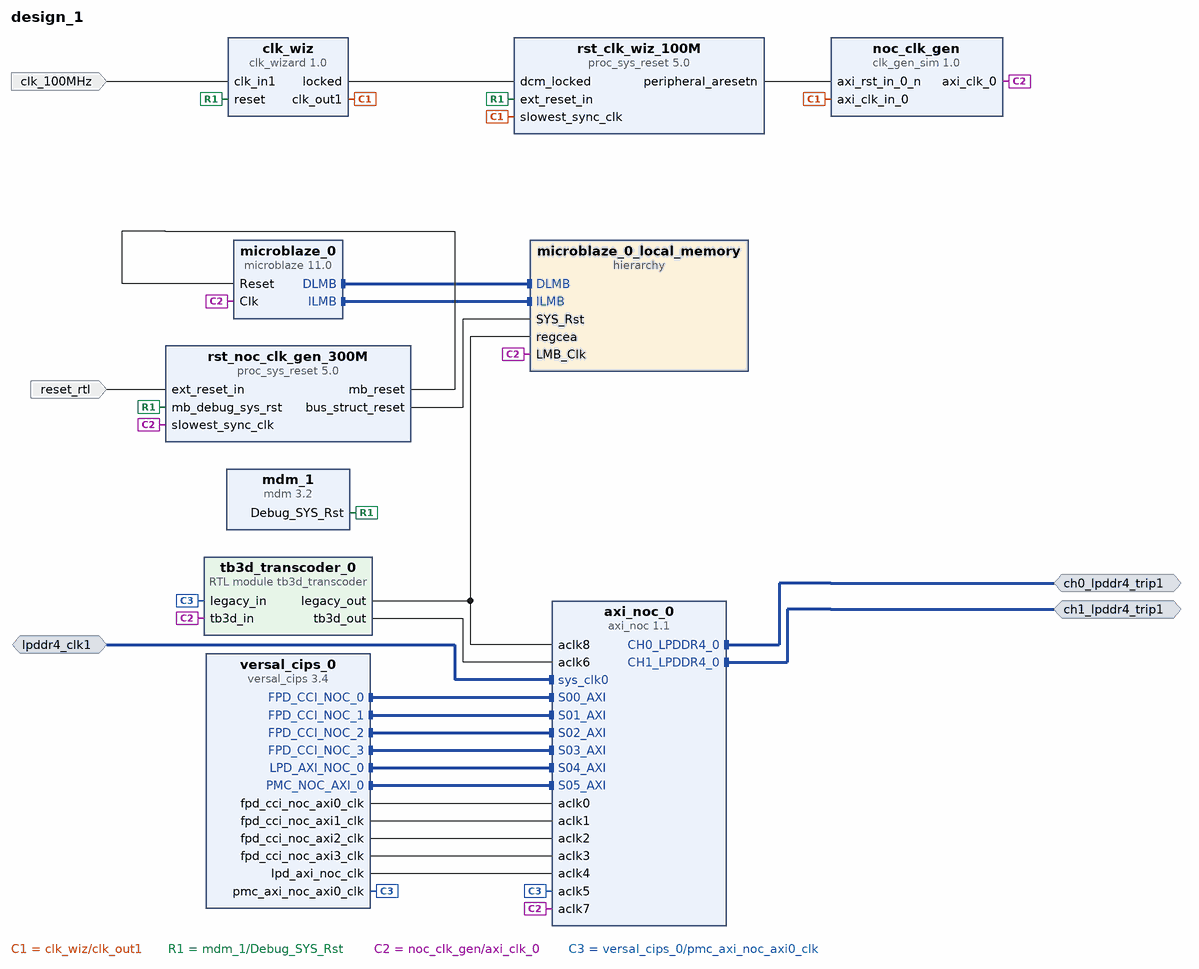
[diagram p0: block diagram of the top level]
# Vivado block design design_1, xcvp1802-lsvc4072-2MP-e-S, Vivado 2025.2
create_bd_design design_1

create_bd_intf_port -mode Master -vlnv xilinx.com:interface:lpddr4_rtl:1.0 ch0_lpddr4_trip1
create_bd_intf_port -mode Master -vlnv xilinx.com:interface:lpddr4_rtl:1.0 ch1_lpddr4_trip1
create_bd_intf_port -mode Slave -vlnv xilinx.com:interface:diff_clock_rtl:1.0 lpddr4_clk1
set_property -dict {CONFIG.FREQ_HZ 200000000} [get_bd_intf_ports lpddr4_clk1]
create_bd_port -dir I -type clk clk_100MHz
set_property -dict {CONFIG.FREQ_HZ 100000000} [get_bd_ports clk_100MHz]
create_bd_port -dir I -type rst reset_rtl
set_property -dict {CONFIG.POLARITY ACTIVE_LOW} [get_bd_ports reset_rtl]

create_bd_cell -type ip -vlnv xilinx.com:ip:microblaze:11.0 microblaze_0
set_property -dict [list \
  CONFIG.C_ADDR_SIZE 32 \
  CONFIG.C_AREA_OPTIMIZED 2 \
  CONFIG.C_DATA_SIZE 64 \
  CONFIG.C_DEBUG_ENABLED 0 \
  CONFIG.C_D_AXI 0 \
  CONFIG.C_D_LMB 1 \
  CONFIG.C_ENABLE_CONVERSION 0 \
  CONFIG.C_ENABLE_DISCRETE_PORTS 0 \
  CONFIG.C_I_AXI 0 \
  CONFIG.C_I_LMB 1 \
  CONFIG.C_M_AXI_DP_DATA_WIDTH 32 \
  CONFIG.C_USE_BRANCH_TARGET_CACHE 1 \
  CONFIG.C_USE_DCACHE 0 \
  CONFIG.C_USE_ICACHE 0 \
  CONFIG.C_USE_MMU 3 \
  CONFIG.C_USE_PCMP_INSTR 1 \
] [get_bd_cells microblaze_0]
create_bd_cell -type module -reference tb3d_transcoder tb3d_transcoder_0
create_bd_cell -type ip -vlnv xilinx.com:ip:axi_noc:1.1 axi_noc_0
set_property -dict [list \
  CONFIG.CH0_LPDDR4_0_BOARD_INTERFACE ch0_lpddr4_trip1 \
  CONFIG.CH1_LPDDR4_0_BOARD_INTERFACE ch1_lpddr4_trip1 \
  CONFIG.MC1_FLIPPED_PINOUT true \
  CONFIG.MC_CHANNEL_INTERLEAVING true \
  CONFIG.MC_CHAN_REGION1 DDR_LOW1 \
  CONFIG.MC_DM_WIDTH 4 \
  CONFIG.MC_DQS_WIDTH 4 \
  CONFIG.MC_DQ_WIDTH 32 \
  CONFIG.MC_EN_INTR_RESP TRUE \
  CONFIG.MC_SYSTEM_CLOCK Differential \
  CONFIG.NUM_CLKS 9 \
  CONFIG.NUM_MC 1 \
  CONFIG.NUM_MCP 4 \
  CONFIG.NUM_MI 0 \
  CONFIG.NUM_SI 6 \
  CONFIG.SI_SIDEBAND_PINS 0,0,0,0,0,0,1 \
  CONFIG.sys_clk0_BOARD_INTERFACE lpddr4_clk1 \
] [get_bd_cells axi_noc_0]
create_bd_cell -type ip -vlnv xilinx.com:ip:versal_cips:3.4 versal_cips_0
set_property -dict [list \
  CONFIG.CPM_CONFIG {CPM_PCIE0_MODES None} \
  CONFIG.DDR_MEMORY_MODE Custom \
  CONFIG.DEBUG_MODE Custom \
  CONFIG.DESIGN_MODE 1 \
  CONFIG.PS_BOARD_INTERFACE ps_pmc_fixed_io \
  CONFIG.PS_PL_CONNECTIVITY_MODE Custom \
  CONFIG.PS_PMC_CONFIG {['DDR_MEMORY_MODE {Connectivity to DDR via NOC}', 'DESIGN_MODE 1', 'DEVICE_INTEGRITY_MODE {Sysmon temperature voltage and external IO monitoring}', 'PMC_GPIO0_MIO_PERIPHERAL {{ENABLE 1} {IO {PMC_MIO 0 .. 25}}}', 'PMC_GPIO1_MIO_PERIPHERAL {{ENABLE 1} {IO {PMC_MIO 26 .. 51}}}', 'PMC_MIO37 {{AUX_IO 0} {DIRECTION out} {DRIVE_STRENGTH 8mA} {OUTPUT_DATA high} {PULL pullup} {SCHMITT 0} {SLEW slow} {USAGE GPIO}}', 'PMC_QSPI_FBCLK {{ENABLE 1} {IO {PMC_MIO 6}}}', 'PMC_QSPI_PERIPHERAL_DATA_MODE x4', 'PMC_QSPI_PERIPHERAL_ENABLE 1', 'PMC_QSPI_PERIPHERAL_MODE {Dual Parallel}', 'PMC_REF_CLK_FREQMHZ 33.3333', 'PMC_SD1 {{CD_ENABLE 1} {CD_IO {PMC_MIO 28}} {POW_ENABLE 1} {POW_IO {PMC_MIO 51}} {RESET_ENABLE 0} {RESET_IO {PMC_MIO 12}} {WP_ENABLE 0} {WP_IO {PMC_MIO 1}}}', 'PMC_SD1_PERIPHERAL {{CLK_100_SDR_OTAP_DLY 0x3} {CLK_200_SDR_OTAP_DLY 0x2} {CLK_50_DDR_ITAP_DLY 0x2A} {CLK_50_DDR_OTAP_DLY 0x3} {CLK_50_SDR_ITAP_DLY 0x25} {CLK_50_SDR_OTAP_DLY 0x4} {ENABLE 1} {IO {PMC_MIO 26 .. 36}}}', 'PMC_SD1_SLOT_TYPE {SD 3.0 AUTODIR}', 'PMC_USE_PMC_NOC_AXI0 1', 'PS_BOARD_INTERFACE ps_pmc_fixed_io', 'PS_ENET0_MDIO {{ENABLE 1} {IO {PS_MIO 24 .. 25}}}', 'PS_ENET0_PERIPHERAL {{ENABLE 1} {IO {PS_MIO 0 .. 11}}}', 'PS_GEN_IPI0_ENABLE 1', 'PS_GEN_IPI0_MASTER A72', 'PS_GEN_IPI1_ENABLE 1', 'PS_GEN_IPI2_ENABLE 1', 'PS_GEN_IPI3_ENABLE 1', 'PS_GEN_IPI4_ENABLE 1', 'PS_GEN_IPI5_ENABLE 1', 'PS_GEN_IPI6_ENABLE 1', 'PS_I2C0_PERIPHERAL {{ENABLE 1} {IO {PMC_MIO 46 .. 47}}}', 'PS_I2C1_PERIPHERAL {{ENABLE 1} {IO {PMC_MIO 44 .. 45}}}', 'PS_I2CSYSMON_PERIPHERAL {{ENABLE 0} {IO {PMC_MIO 39 .. 40}}}', 'PS_MIO7 {{AUX_IO 0} {DIRECTION in} {DRIVE_STRENGTH 8mA} {OUTPUT_DATA default} {PULL disable} {SCHMITT 0} {SLEW slow} {USAGE Reserved}}', 'PS_MIO9 {{AUX_IO 0} {DIRECTION in} {DRIVE_STRENGTH 8mA} {OUTPUT_DATA default} {PULL disable} {SCHMITT 0} {SLEW slow} {USAGE Reserved}}', 'PS_M_AXI_FPD_DATA_WIDTH 32', 'PS_NUM_FABRIC_RESETS 0', 'PS_PCIE_EP_RESET1_IO {PS_MIO 18}', 'PS_PCIE_EP_RESET2_IO {PS_MIO 19}', 'PS_PCIE_RESET {ENABLE 1}', 'PS_PL_CONNECTIVITY_MODE Custom', 'PS_S_AXI_FPD_DATA_WIDTH 32', 'PS_UART0_PERIPHERAL {{ENABLE 1} {IO {PMC_MIO 42 .. 43}}}', 'PS_USB3_PERIPHERAL {{ENABLE 1} {IO {PMC_MIO 13 .. 25}}}', 'PS_USE_FPD_CCI_NOC 1', 'PS_USE_FPD_CCI_NOC0 1', 'PS_USE_M_AXI_FPD 0', 'PS_USE_NOC_LPD_AXI0 1', 'PS_USE_PMCPL_CLK0 0', 'PS_USE_PMCPL_CLK1 0', 'PS_USE_PMCPL_CLK2 0', 'PS_USE_PMCPL_CLK3 0', 'PS_USE_S_AXI_FPD 0', 'SMON_ALARMS Set_Alarms_On', 'SMON_ENABLE_TEMP_AVERAGING 0', 'SMON_INTERFACE_TO_USE I2C', 'SMON_PMBUS_ADDRESS 0x18', 'SMON_TEMP_AVERAGING_SAMPLES 0']} \
] [get_bd_cells versal_cips_0]
create_bd_cell -type hier microblaze_0_local_memory
create_bd_cell -type ip -vlnv xilinx.com:ip:mdm:3.2 mdm_1
create_bd_cell -type ip -vlnv xilinx.com:ip:proc_sys_reset:5.0 rst_noc_clk_gen_300M
create_bd_cell -type ip -vlnv xilinx.com:ip:clk_wizard:1.0 clk_wiz
set_property -dict [list \
  CONFIG.CLKOUT_REQUESTED_OUT_FREQUENCY 100.0 \
  CONFIG.USE_LOCKED true \
  CONFIG.USE_RESET true \
] [get_bd_cells clk_wiz]
create_bd_cell -type ip -vlnv xilinx.com:ip:clk_gen_sim:1.0 noc_clk_gen
set_property -dict {CONFIG.USER_AXI_CLK_0_FREQ 300.0 CONFIG.USER_NUM_OF_AXI_CLK 1} [get_bd_cells noc_clk_gen]
create_bd_cell -type ip -vlnv xilinx.com:ip:proc_sys_reset:5.0 rst_clk_wiz_100M

# ---- hierarchy /microblaze_0_local_memory ----
current_bd_instance /microblaze_0_local_memory
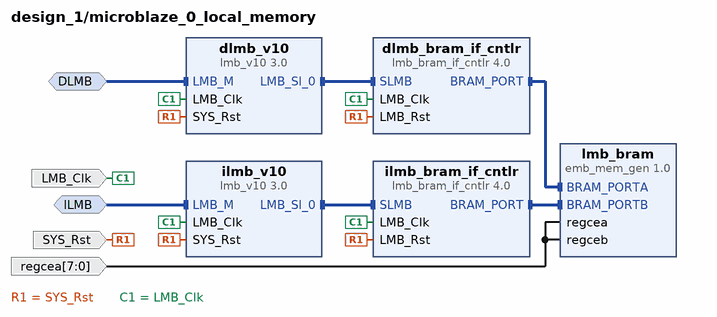
[diagram p1: block diagram inside /microblaze_0_local_memory]
create_bd_intf_pin -mode MirroredMaster -vlnv xilinx.com:interface:lmb_rtl:1.0 DLMB
create_bd_intf_pin -mode MirroredMaster -vlnv xilinx.com:interface:lmb_rtl:1.0 ILMB
create_bd_pin -dir I -type clk LMB_Clk
create_bd_pin -dir I -type rst SYS_Rst
create_bd_pin -dir I -from 7 -to 0 regcea

create_bd_cell -type ip -vlnv xilinx.com:ip:lmb_v10:3.0 dlmb_v10
create_bd_cell -type ip -vlnv xilinx.com:ip:lmb_v10:3.0 ilmb_v10
create_bd_cell -type ip -vlnv xilinx.com:ip:lmb_bram_if_cntlr:4.0 dlmb_bram_if_cntlr
set_property -dict {CONFIG.C_ECC 0} [get_bd_cells dlmb_bram_if_cntlr]
create_bd_cell -type ip -vlnv xilinx.com:ip:lmb_bram_if_cntlr:4.0 ilmb_bram_if_cntlr
set_property -dict {CONFIG.C_ECC 0} [get_bd_cells ilmb_bram_if_cntlr]
create_bd_cell -type ip -vlnv xilinx.com:ip:emb_mem_gen:1.0 lmb_bram
set_property -dict {CONFIG.MEMORY_TYPE True_Dual_Port_RAM CONFIG.READ_LATENCY_A 1 CONFIG.READ_LATENCY_B 1} [get_bd_cells lmb_bram]

# ---- connections ----

current_bd_instance /microblaze_0_local_memory
connect_bd_intf_net -intf_net microblaze_0_dlmb [get_bd_intf_pins dlmb_v10/LMB_M] [get_bd_intf_pins DLMB]
connect_bd_intf_net -intf_net microblaze_0_dlmb_bus [get_bd_intf_pins dlmb_v10/LMB_Sl_0] [get_bd_intf_pins dlmb_bram_if_cntlr/SLMB]
connect_bd_intf_net -intf_net microblaze_0_dlmb_cntlr [get_bd_intf_pins dlmb_bram_if_cntlr/BRAM_PORT] [get_bd_intf_pins lmb_bram/BRAM_PORTA]
connect_bd_intf_net -intf_net microblaze_0_ilmb [get_bd_intf_pins ilmb_v10/LMB_M] [get_bd_intf_pins ILMB]
connect_bd_intf_net -intf_net microblaze_0_ilmb_bus [get_bd_intf_pins ilmb_v10/LMB_Sl_0] [get_bd_intf_pins ilmb_bram_if_cntlr/SLMB]
connect_bd_intf_net -intf_net microblaze_0_ilmb_cntlr [get_bd_intf_pins ilmb_bram_if_cntlr/BRAM_PORT] [get_bd_intf_pins lmb_bram/BRAM_PORTB]
connect_bd_net [get_bd_pins SYS_Rst] \
  [get_bd_pins dlmb_v10/SYS_Rst] [get_bd_pins dlmb_bram_if_cntlr/LMB_Rst] [get_bd_pins ilmb_v10/SYS_Rst] \
  [get_bd_pins ilmb_bram_if_cntlr/LMB_Rst]
connect_bd_net -net microblaze_0_Clk [get_bd_pins LMB_Clk] \
  [get_bd_pins dlmb_v10/LMB_Clk] [get_bd_pins dlmb_bram_if_cntlr/LMB_Clk] [get_bd_pins ilmb_v10/LMB_Clk] \
  [get_bd_pins ilmb_bram_if_cntlr/LMB_Clk]
connect_bd_net [get_bd_pins regcea] [get_bd_pins lmb_bram/regcea] [get_bd_pins lmb_bram/regceb]
set_property HDL_ATTRIBUTE.BMM_INFO_ADDRESS_SPACE {byte  0x00000000 32 > design_1 microblaze_0_local_memory/lmb_bram} [get_bd_cells dlmb_bram_if_cntlr]
set_property HDL_ATTRIBUTE.KEEP_HIERARCHY yes [get_bd_cells dlmb_bram_if_cntlr]

current_bd_instance /
connect_bd_intf_net [get_bd_intf_ports ch0_lpddr4_trip1] [get_bd_intf_pins axi_noc_0/CH0_LPDDR4_0]
connect_bd_intf_net [get_bd_intf_ports ch1_lpddr4_trip1] [get_bd_intf_pins axi_noc_0/CH1_LPDDR4_0]
connect_bd_intf_net -intf_net lpddr4_clk1_1 [get_bd_intf_ports lpddr4_clk1] [get_bd_intf_pins axi_noc_0/sys_clk0]
connect_bd_intf_net [get_bd_intf_pins microblaze_0_local_memory/DLMB] [get_bd_intf_pins microblaze_0/DLMB]
connect_bd_intf_net [get_bd_intf_pins microblaze_0_local_memory/ILMB] [get_bd_intf_pins microblaze_0/ILMB]
connect_bd_intf_net [get_bd_intf_pins versal_cips_0/FPD_CCI_NOC_0] [get_bd_intf_pins axi_noc_0/S00_AXI]
connect_bd_intf_net [get_bd_intf_pins versal_cips_0/FPD_CCI_NOC_1] [get_bd_intf_pins axi_noc_0/S01_AXI]
connect_bd_intf_net [get_bd_intf_pins versal_cips_0/FPD_CCI_NOC_2] [get_bd_intf_pins axi_noc_0/S02_AXI]
connect_bd_intf_net [get_bd_intf_pins versal_cips_0/FPD_CCI_NOC_3] [get_bd_intf_pins axi_noc_0/S03_AXI]
connect_bd_intf_net [get_bd_intf_pins versal_cips_0/LPD_AXI_NOC_0] [get_bd_intf_pins axi_noc_0/S04_AXI]
connect_bd_intf_net [get_bd_intf_pins versal_cips_0/PMC_NOC_AXI_0] [get_bd_intf_pins axi_noc_0/S05_AXI]
connect_bd_net [get_bd_ports clk_100MHz] [get_bd_pins clk_wiz/clk_in1]
connect_bd_net [get_bd_pins clk_wiz/clk_out1] [get_bd_pins noc_clk_gen/axi_clk_in_0] [get_bd_pins rst_clk_wiz_100M/slowest_sync_clk]
connect_bd_net [get_bd_pins clk_wiz/locked] [get_bd_pins rst_clk_wiz_100M/dcm_locked]
connect_bd_net [get_bd_pins mdm_1/Debug_SYS_Rst] \
  [get_bd_pins rst_noc_clk_gen_300M/mb_debug_sys_rst] [get_bd_pins clk_wiz/reset] [get_bd_pins rst_clk_wiz_100M/ext_reset_in]
connect_bd_net -net microblaze_0_Clk [get_bd_pins noc_clk_gen/axi_clk_0] \
  [get_bd_pins microblaze_0/Clk] [get_bd_pins microblaze_0_local_memory/LMB_Clk] \
  [get_bd_pins rst_noc_clk_gen_300M/slowest_sync_clk] [get_bd_pins axi_noc_0/aclk7] [get_bd_pins tb3d_transcoder_0/tb3d_in]
connect_bd_net [get_bd_ports reset_rtl] [get_bd_pins rst_noc_clk_gen_300M/ext_reset_in]
connect_bd_net [get_bd_pins rst_clk_wiz_100M/peripheral_aresetn] [get_bd_pins noc_clk_gen/axi_rst_in_0_n]
connect_bd_net [get_bd_pins rst_noc_clk_gen_300M/bus_struct_reset] [get_bd_pins microblaze_0_local_memory/SYS_Rst]
connect_bd_net [get_bd_pins rst_noc_clk_gen_300M/mb_reset] [get_bd_pins microblaze_0/Reset]
connect_bd_net [get_bd_pins tb3d_transcoder_0/legacy_out] [get_bd_pins microblaze_0_local_memory/regcea] [get_bd_pins axi_noc_0/aclk8]
connect_bd_net [get_bd_pins tb3d_transcoder_0/tb3d_out] [get_bd_pins axi_noc_0/aclk6]
connect_bd_net [get_bd_pins versal_cips_0/fpd_cci_noc_axi0_clk] [get_bd_pins axi_noc_0/aclk0]
connect_bd_net [get_bd_pins versal_cips_0/fpd_cci_noc_axi1_clk] [get_bd_pins axi_noc_0/aclk1]
connect_bd_net [get_bd_pins versal_cips_0/fpd_cci_noc_axi2_clk] [get_bd_pins axi_noc_0/aclk2]
connect_bd_net [get_bd_pins versal_cips_0/fpd_cci_noc_axi3_clk] [get_bd_pins axi_noc_0/aclk3]
connect_bd_net [get_bd_pins versal_cips_0/lpd_axi_noc_clk] [get_bd_pins axi_noc_0/aclk4]
connect_bd_net [get_bd_pins versal_cips_0/pmc_axi_noc_axi0_clk] [get_bd_pins tb3d_transcoder_0/legacy_in] [get_bd_pins axi_noc_0/aclk5]
set_property HDL_ATTRIBUTE.BMM_INFO_PROCESSOR {microblaze-le > design_1 microblaze_0_local_memory/dlmb_bram_if_cntlr} [get_bd_cells microblaze_0]
set_property HDL_ATTRIBUTE.KEEP_HIERARCHY yes [get_bd_cells microblaze_0]

# ---- address map ----
assign_bd_address -offset 0x00000000 -range 8K -target_address_space [get_bd_addr_spaces microblaze_0/Data] [get_bd_addr_segs microblaze_0_local_memory/dlmb_bram_if_cntlr/SLMB/Mem]
assign_bd_address -offset 0x00000000 -range 8K -target_address_space [get_bd_addr_spaces microblaze_0/Instruction] [get_bd_addr_segs microblaze_0_local_memory/ilmb_bram_if_cntlr/SLMB/Mem]
assign_bd_address -offset 0x0000000000000000 -range 2G -target_address_space [get_bd_addr_spaces versal_cips_0/FPD_CCI_NOC_0] [get_bd_addr_segs axi_noc_0/S00_AXI/C3_DDR_LOW0]
assign_bd_address -offset 0x0000000800000000 -range 2G -target_address_space [get_bd_addr_spaces versal_cips_0/FPD_CCI_NOC_0] [get_bd_addr_segs axi_noc_0/S00_AXI/C3_DDR_LOW1]
assign_bd_address -offset 0x0000000000000000 -range 2G -target_address_space [get_bd_addr_spaces versal_cips_0/FPD_CCI_NOC_1] [get_bd_addr_segs axi_noc_0/S01_AXI/C2_DDR_LOW0]
assign_bd_address -offset 0x0000000800000000 -range 2G -target_address_space [get_bd_addr_spaces versal_cips_0/FPD_CCI_NOC_1] [get_bd_addr_segs axi_noc_0/S01_AXI/C2_DDR_LOW1]
assign_bd_address -offset 0x0000000000000000 -range 2G -target_address_space [get_bd_addr_spaces versal_cips_0/FPD_CCI_NOC_2] [get_bd_addr_segs axi_noc_0/S02_AXI/C0_DDR_LOW0]
assign_bd_address -offset 0x0000000800000000 -range 2G -target_address_space [get_bd_addr_spaces versal_cips_0/FPD_CCI_NOC_2] [get_bd_addr_segs axi_noc_0/S02_AXI/C0_DDR_LOW1]
assign_bd_address -offset 0x0000000000000000 -range 2G -target_address_space [get_bd_addr_spaces versal_cips_0/FPD_CCI_NOC_3] [get_bd_addr_segs axi_noc_0/S03_AXI/C1_DDR_LOW0]
assign_bd_address -offset 0x0000000800000000 -range 2G -target_address_space [get_bd_addr_spaces versal_cips_0/FPD_CCI_NOC_3] [get_bd_addr_segs axi_noc_0/S03_AXI/C1_DDR_LOW1]
assign_bd_address -offset 0x0000000000000000 -range 2G -target_address_space [get_bd_addr_spaces versal_cips_0/LPD_AXI_NOC_0] [get_bd_addr_segs axi_noc_0/S04_AXI/C3_DDR_LOW0]
assign_bd_address -offset 0x0000000800000000 -range 2G -target_address_space [get_bd_addr_spaces versal_cips_0/LPD_AXI_NOC_0] [get_bd_addr_segs axi_noc_0/S04_AXI/C3_DDR_LOW1]
assign_bd_address -offset 0x0000000000000000 -range 2G -target_address_space [get_bd_addr_spaces versal_cips_0/PMC_NOC_AXI_0] [get_bd_addr_segs axi_noc_0/S05_AXI/C2_DDR_LOW0]
assign_bd_address -offset 0x0000000800000000 -range 2G -target_address_space [get_bd_addr_spaces versal_cips_0/PMC_NOC_AXI_0] [get_bd_addr_segs axi_noc_0/S05_AXI/C2_DDR_LOW1]

validate_bd_design
save_bd_design
